# Altium schematic sheet 05-STM32.SchDoc
size A4; DocumentNumber: 5; SheetNumber: 5; SheetTotal: 8
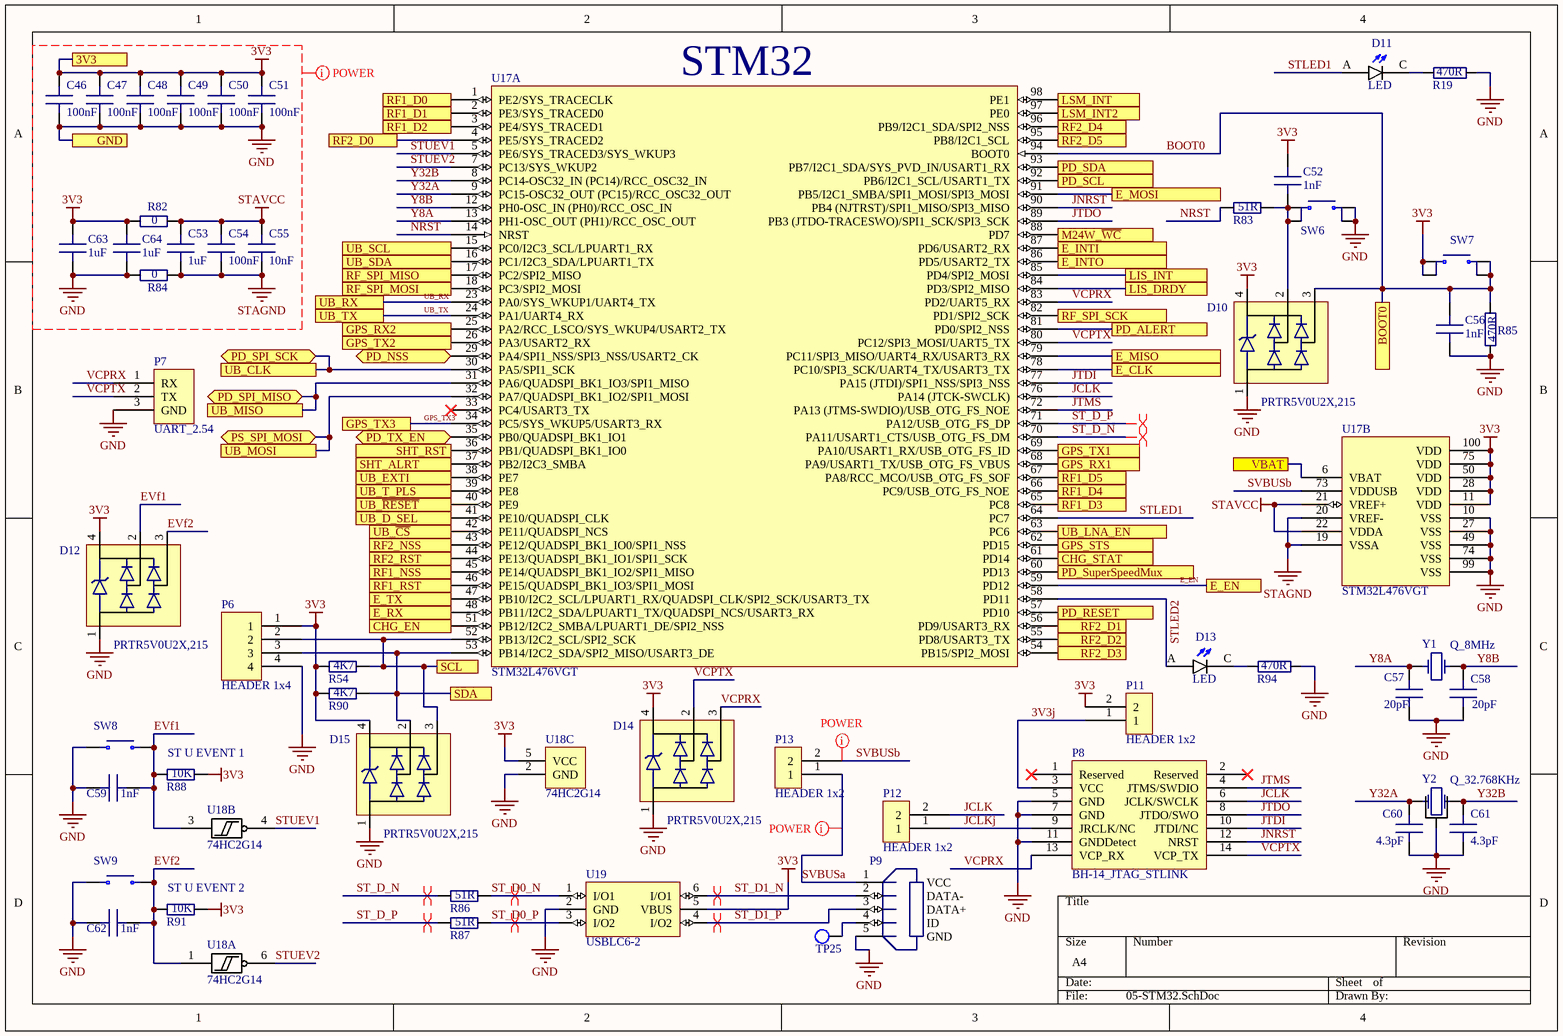
[diagram p0: 05-STM32.SchDoc]

## Parts
C46  100nF  [C0603]
C47  100nF  [C0603_NOSILK]
C48  100nF  [C0603]
C49  100nF  [C0603]
C50  100nF  [C0603]
C51  100nF  [C0603]
C52  1nF  [C0603]
C53  1uF  [C0805]
C54  100nF  [C0603]
C55  10nF  [C0603]
C56  1nF  [C0603]
C57  20pF  [C0603]
C58  20pF  [C0603]
C59  1nF  [C0603]
C60  4.3pF  [C0603]
C61  4.3pF  [C0603]
C62  1nF  [C0603]
C63  1uF  [C0805]
C64  1uF  [C0805]
D10  PRTR5V0U2X,215  [SOT143B]
D11  LED  [LED_0604]
D12  PRTR5V0U2X,215  [SOT143B]
D13  LED  [LED_0604]
D14  PRTR5V0U2X,215  [SOT143B]
D15  PRTR5V0U2X,215  [SOT143B]
P6  HEADER 1x4  [HEADER 1x4 2.54]
P7  UART_2.54  [UART_2.54]
P8  BH-14_JTAG_STLINK  [BH-14-1.27]
P9  440247-2  [CON-UUSB-F-2]  (value not drawn)
P11  HEADER 1x2  [HEADER 1x2 2.54]
P12  HEADER 1x2  [HEADER 1x2 2.54]
P13  HEADER 1x2  [HEADER 1x2 2.54]
R19  Resistance: 470R  [R0603]
R54  Resistance: 4K7  [R0603]
R82  Resistance: 0  [R0603]
R83  Resistance: 51R  [R0402]
R84  Resistance: 0  [R0603]
R85  Resistance: 470R  [R0603]
R86  Resistance: 51R  [R0402]
R87  Resistance: 51R  [R0402]
R88  Resistance: 10K  [R0603]
R90  Resistance: 4K7  [R0603]
R91  Resistance: 10K  [R0603]
R94  Resistance: 470R  [R0603]
SW6  SWITCH_GEN_4P  [SW_4x4x1.5]  (value not drawn)
SW7  SWITCH_GEN_4P  [SW_4x4x1.5]  (value not drawn)
SW8  SWITCH_GEN_2P  [SW_TACTM-35N-F]  (value not drawn)
SW9  SWITCH_GEN_2P  [SW_TACTM-35N-F]  (value not drawn)
TP25  TEST_POINT  [TP_1mm]  (value not drawn)  (no BOM)
U17  STM32L476VGT  [LQFP100_0.5]  (parts A,B of 2)
U18  74HC2G14  [SOT363/SOT65P210X110-6N]  (parts A,B,C of 3)
U19  USBLC6-2  [SOT-666]
Y1  Q_8MHz  [QSMD12.3x4.5x4.2]
Y2  Q_32.768KHz  [HC_3.0x8.0]

## Ports
3V3, BOOT0, CHG_EN, CHG_STAT, E_CLK, E_EN, E_INTI, E_INTO, E_MISO, E_MOSI, E_RX, E_TX, GND, GPS_RX1, GPS_RX2, GPS_STS, GPS_TX1, GPS_TX2, GPS_TX3, LIS_DRDY, LIS_INT, LSM_INT, LSM_INT2, M24W_~{WC}, PD_ALERT, PD_NSS (bidir), PD_RESET, PD_SCL, PD_SDA, PD_SPI_MISO (bidir), PD_SPI_SCK (bidir), PD_SuperSpeedMux, PD_TX_EN (bidir), PS_SPI_MOSI (bidir), RF1_D0, RF1_D1, RF1_D2, RF1_D3, RF1_D4, RF1_D5, RF1_NSS, RF1_RST, RF2_D0, RF2_D1, RF2_D2, RF2_D3, RF2_D4, RF2_D5, RF2_NSS, RF2_RST, RF_SPI_MISO, RF_SPI_MOSI, RF_SPI_SCK, SCL, SDA, SHT_ALRT, SHT_RST, UB_CLK, UB_D_SEL, UB_EXTI, UB_LNA_EN, UB_MISO, UB_MOSI, UB_RX, UB_SCL, UB_SDA, UB_T_PLS, UB_TX, UB_~{CS}, UB_~{RESET}, VBAT

## Nets
3V3: C46.2 C47.2 C48.2 C49.2 C50.2 C51.2 C52.1 C63.2 C64.2 D10.4(P$4) D12.4(P$4) D14.4(P$4) D15.4(P$4) P6.1 P11.2 R54.1 R82.1 R88.2 R90.1 R91.2 SW7.2 SW7.4 U17.11(VDD) U17.28(VDD) U17.50(VDD) U17.75(VDD) U17.100(VDD) U18.5(VCC) U19.5(VBUS) ; port 3V3
GND: C46.1 C47.1 C48.1 C49.1 C50.1 C51.1 C56.2 C57.1 C58.1 C59.2 C60.1 C61.1 C62.2 C63.1 C64.1 D10.1(P$1) D12.1(P$1) D14.1(P$1) D15.1(P$1) P6.4 P7.3(GND) P8.5(GND) P8.7(GND) P8.11(GNDDetect) P9.5(GND) R19.2 R84.1 R85.1 R94.2 SW6.1 SW6.3 SW8.1 SW9.1 U17.10(VSS) U17.27(VSS) U17.49(VSS) U17.74(VSS) U17.99(VSS) U18.2(GND) U19.2(GND) Y2.PAD ; port GND
STAGND: C53.1 C54.1 C55.1 R84.2 U17.19(VSSA) U17.20(VREF-)
STAVCC: C53.2 C54.2 C55.2 R82.2 U17.21(VREF+) U17.22(VDDA)
3V3j: P8.3(VCC) P11.1
BOOT0: C56.1 D10.3(P$3) R85.2 SW7.1 SW7.3 U17.94(BOOT0) ; port BOOT0
CHG_EN: U17.51(PB12/I2C2_SMBA/LPUART1_DE/SPI2_NSS) ; port CHG_EN
CHG_STAT: U17.61(PD14) ; port CHG_STAT
E_CLK: U17.78(PC10/SPI3_SCK/UART4_TX/USART3_TX) ; port E_CLK
E_EN: U17.59(PD12) ; port E_EN
E_INTI: U17.87(PD6/USART2_RX) ; port E_INTI
E_INTO: U17.86(PD5/USART2_TX) ; port E_INTO
E_MISO: U17.79(PC11/SPI3_MISO/UART4_RX/USART3_RX) ; port E_MISO
E_MOSI: U17.91(PB5/I2C1_SMBA/SPI1_MOSI/SPI3_MOSI) ; port E_MOSI
E_RX: U17.48(PB11/I2C2_SDA/LPUART1_TX/QUADSPI_NCS/USART3_RX) ; port E_RX
E_TX: U17.47(PB10/I2C2_SCL/LPUART1_RX/QUADSPI_CLK/SPI2_SCK/USART3_TX) ; port E_TX
EVf1: C59.1 D12.2(P$2) R88.1 SW8.2 U18.3(2A)
EVf2: C62.1 D12.3(P$3) R91.1 SW9.2 U18.1(1A)
GPS_RX1: U17.68(PA9/USART1_TX/USB_OTG_FS_VBUS) ; port GPS_RX1
GPS_RX2: U17.25(PA2/RCC_LSCO/SYS_WKUP4/USART2_TX) ; port GPS_RX2
GPS_STS: U17.62(PD15) ; port GPS_STS
GPS_TX1: U17.69(PA10/USART1_RX/USB_OTG_FS_ID) ; port GPS_TX1
GPS_TX2: U17.26(PA3/USART2_RX) ; port GPS_TX2
GPS_TX3: U17.34(PC5/SYS_WKUP5/USART3_RX) ; port GPS_TX3
JCLK: P8.6(JCLK/SWCLK) P12.2 U17.76(PA14_(JTCK-SWCLK))
JCLKj: P8.9(JRCLK/NC) P12.1
JNRST: P8.12(NRST) U17.90(PB4_(NJTRST)/SPI1_MISO/SPI3_MISO)
JTDI: P8.10(JTDI/NC) U17.77(PA15_(JTDI)/SPI1_NSS/SPI3_NSS)
JTDO: P8.8(JTDO/SWO) U17.89(PB3_(JTDO-TRACESWO)/SPI1_SCK/SPI3_SCK)
JTMS: P8.4(JTMS/SWDIO) U17.72(PA13_(JTMS-SWDIO)/USB_OTG_FS_NOE)
LIS_DRDY: U17.84(PD3/SPI2_MISO) ; port LIS_DRDY
LIS_INT: U17.85(PD4/SPI2_MOSI) ; port LIS_INT
LSM_INT: U17.98(PE1) ; port LSM_INT
LSM_INT2: U17.97(PE0) ; port LSM_INT2
M24W_~{WC}: U17.88(PD7) ; port M24W_~{WC}
NRST: R83.1 U17.14(NRST)
PD_ALERT: U17.81(PD0/SPI2_NSS) ; port PD_ALERT
PD_NSS: U17.29(PA4/SPI1_NSS/SPI3_NSS/USART2_CK) ; port PD_NSS
PD_RESET: U17.57(PD10) ; port PD_RESET
PD_SCL: U17.92(PB6/I2C1_SCL/USART1_TX) ; port PD_SCL
PD_SDA: U17.93(PB7/I2C1_SDA/SYS_PVD_IN/USART1_RX) ; port PD_SDA
PD_SPI_MISO: U17.31(PA6/QUADSPI_BK1_IO3/SPI1_MISO) ; port UB_MISO, port PD_SPI_MISO
PD_SPI_SCK: U17.30(PA5/SPI1_SCK) ; port PD_SPI_SCK, port UB_CLK
PD_SuperSpeedMux: U17.60(PD13) ; port PD_SuperSpeedMux
PD_TX_EN: U17.35(PB0/QUADSPI_BK1_IO1) ; port PD_TX_EN
PS_SPI_MOSI: U17.32(PA7/QUADSPI_BK1_IO2/SPI1_MOSI) ; port PS_SPI_MOSI, port UB_MOSI
RF1_D0: U17.1(PE2/SYS_TRACECLK) ; port RF1_D0
RF1_D1: U17.2(PE3/SYS_TRACED0) ; port RF1_D1
RF1_D2: U17.3(PE4/SYS_TRACED1) ; port RF1_D2
RF1_D3: U17.65(PC8) ; port RF1_D3
RF1_D4: U17.66(PC9/USB_OTG_FS_NOE) ; port RF1_D4
RF1_D5: U17.67(PA8/RCC_MCO/USB_OTG_FS_SOF) ; port RF1_D5
RF1_NSS: U17.45(PE14/QUADSPI_BK1_IO2/SPI1_MISO) ; port RF1_NSS
RF1_RST: U17.46(PE15/QUADSPI_BK1_IO3/SPI1_MOSI) ; port RF1_RST
RF2_D0: U17.4(PE5/SYS_TRACED2) ; port RF2_D0
RF2_D1: U17.56(PD9/USART3_RX) ; port RF2_D1
RF2_D2: U17.55(PD8/USART3_TX) ; port RF2_D2
RF2_D3: U17.54(PB15/SPI2_MOSI) ; port RF2_D3
RF2_D4: U17.96(PB9/I2C1_SDA/SPI2_NSS) ; port RF2_D4
RF2_D5: U17.95(PB8/I2C1_SCL) ; port RF2_D5
RF2_NSS: U17.43(PE12/QUADSPI_BK1_IO0/SPI1_NSS) ; port RF2_NSS
RF2_RST: U17.44(PE13/QUADSPI_BK1_IO1/SPI1_SCK) ; port RF2_RST
RF_SPI_MISO: U17.17(PC2/SPI2_MISO) ; port RF_SPI_MISO
RF_SPI_MOSI: U17.18(PC3/SPI2_MOSI) ; port RF_SPI_MOSI
RF_SPI_SCK: U17.82(PD1/SPI2_SCK) ; port RF_SPI_SCK
SCL: D15.3(P$3) P6.2 R54.2 U17.52(PB13/I2C2_SCL/SPI2_SCK) ; port SCL
SDA: D15.2(P$2) P6.3 R90.2 U17.53(PB14/I2C2_SDA/SPI2_MISO/USART3_DE) ; port SDA
SHT_ALRT: U17.37(PB2/I2C3_SMBA) ; port SHT_ALRT
SHT_RST: U17.36(PB1/QUADSPI_BK1_IO0) ; port SHT_RST
ST_D0_N: R86.2 U19.1(I/O1)
ST_D0_P: R87.2 U19.3(I/O2)
ST_D1_N: P9.2(DATA-) U19.6(I/O1)
ST_D1_P: P9.3(DATA+) U19.4(I/O2)
ST_D_N: R86.1 U17.70(PA11/USART1_CTS/USB_OTG_FS_DM)
ST_D_P: R87.1 U17.71(PA12/USB_OTG_FS_DP)
STLED1: D11.A U17.64(PC7)
STLED2: D13.A U17.58(PD11)
STUEV1: U17.5(PE6/SYS_TRACED3/SYS_WKUP3) U18.4(2Y)
STUEV2: U17.7(PC13/SYS_WKUP2) U18.6(1Y)
SVBUSa: P9.1(VCC) P13.1
SVBUSb: P13.2 U17.73(VDDUSB)
UB_~{CS}: U17.42(PE11/QUADSPI_NCS) ; port UB_~{CS}
UB_D_SEL: U17.41(PE10/QUADSPI_CLK) ; port UB_D_SEL
UB_EXTI: U17.38(PE7) ; port UB_EXTI
UB_LNA_EN: U17.63(PC6) ; port UB_LNA_EN
UB_~{RESET}: U17.40(PE9) ; port UB_~{RESET}
UB_RX: U17.23(PA0/SYS_WKUP1/UART4_TX) ; port UB_RX
UB_SCL: U17.15(PC0/I2C3_SCL/LPUART1_RX) ; port UB_SCL
UB_SDA: U17.16(PC1/I2C3_SDA/LPUART1_TX) ; port UB_SDA
UB_T_PLS: U17.39(PE8) ; port UB_T_PLS
UB_TX: U17.24(PA1/UART4_RX) ; port UB_TX
VBAT: U17.6(VBAT) ; port VBAT
VCPRX: D14.3(P$3) P7.1(RX) P8.13(VCP_RX) U17.83(PD2/UART5_RX)
VCPTX: D14.2(P$2) P7.2(TX) P8.14(VCP_TX) U17.80(PC12/SPI3_MOSI/UART5_TX)
Y8A: C57.2 U17.13(PH1-OSC_OUT_(PH1)/RCC_OSC_OUT) Y1.1
Y8B: C58.2 U17.12(PH0-OSC_IN_(PH0)/RCC_OSC_IN) Y1.2
Y32A: C60.2 U17.9(PC15-OSC32_OUT_(PC15)/RCC_OSC32_OUT) Y2.1
Y32B: C61.2 U17.8(PC14-OSC32_IN_(PC14)/RCC_OSC32_IN) Y2.2
NetC52_2: C52.2 D10.2(P$2) R83.2 SW6.2 SW6.4
NetD11_C: D11.C R19.1
NetD13_C: D13.C R94.1
NetP9_4: P9.4(ID) TP25.1

Not connected (* = marked no-connect by the designer): P8 1(Reserved)* 2(Reserved)*; U17 33(PC4/USART3_TX)*

## Layout directives
differential pair; net class USB: ST_D0_N, ST_D0_P, ST_D1_N, ST_D1_P, ST_D_N, ST_D_P
net class POWER_NET_CLASS: 3V3, GND, STAGND, STAVCC, SVBUSa, SVBUSb
differential pair: ST_D_N, ST_D_P

## Notes on the sheet
- (near U17) STM32
- (near R88) ST U EVENT 1
- (near R91) ST U EVENT 2

## Library data of the parts
C46-C51 C54 = C0603_100nF_16V: Ceramic capacitor; Voltage: 16V; Capacity: 100nF; Size: 0603; Value: 100nF; PriceKosmodromUAH: 1; Kosmodrom: http://www.kosmodrom.com.ua/el.php?name=CP06030.125V8020
C52 C56 C59 C62 = C0603_1nF_25V: Ceramic capacitor; Voltage: 25V; Capacity: 1nF; Size: 0603; Value: 1nF; PriceKosmodromUAH: 0,75; Kosmodrom: http://www.kosmodrom.com.ua/el.php?name=CP0603100050V10
C53 C63 C64 = C0805_1uF_25V: Ceramic capacitor; Voltage: 25V; Capacity: 1uF; Size: 0805; Value: 1uF; PriceKosmodromUAH: 1; Kosmodrom: http://www.kosmodrom.com.ua/el.php?name=CP0805125V10
C55 = C0603_10nF_16V: Ceramic capacitor; Voltage: 16V; Capacity: 10nF; Size: 0603; Value: 10nF; PriceKosmodromUAH: 0,25; Kosmodrom: http://www.kosmodrom.com.ua/el.php?name=CP06031050V10
C57 C58 = C0603_20pF_50V: Ceramic capacitor; Voltage: 25V; Capacity: 20pF; Size: 0603; Value: 20pF; PriceKosmodromUAH: 0,25; Kosmodrom: http://www.kosmodrom.com.ua/el.php?name=CP06032050V5
C60 C61 = C0603_4.3pF_50V: Ceramic capacitor; Voltage: 25V; Capacity: 4.3pF; Size: 0603; Value: 4.3pF; PriceKosmodromUAH: 0,25; Kosmodrom: http://www.kosmodrom.com.ua/el.php?name=CP06034.350V0.25
D10 D12 D14 D15 = PRTR5V0U2X,215: PRTR5V0U2X - Ultra low capacitance double rail-to-rail ESD protection diode; MF: Nexperia USA; Owned: 10; Package: SOT-143 Nexperia; Price: None; Availability: Unavailable; MP: PRTR5V0U2X,215; SnapEDA_Link: https://www.snapeda.com/parts/PRTR5V0U2X%2C215/Nexperia%20USA%20Inc./view-part/?ref=snap; Value: *; PriceKosmodromUAH: 3,25; Kosmodrom: http://www.kosmodrom.com.ua/el.php?name=PRTR5V0U2X.215
D11 D13 = LED: Led General; MF: Dialight; MP: 598-8140-107F; Owned: 3000; SnapEDA_Link: https://www.snapeda.com/parts/598-8140-107F/Dialight/view-part/?ref=snap; Price: None; Availability: Unavailable; Package: 0805 Dialight; Value: *
P8 = BH-14_JTAG_STLINK: 1,27 mm 2x7 Header; Owned: 10; PriceKosmodromUAH: 7,75; Kosmodrom: http://www.kosmodrom.com.ua/el.php?name=BH1.27-14
P9 = CON-USB-Micro/Mini: Mini/Micro USB B Type RCPT; MF: TE Connectivity; Availability: Unavailable; Package: None; MP: 440247-2; SnapEDA_Link: https://www.snapeda.com/parts/440247-2/TE%20Connectivity%20AMP%20Connectors/view-part/?ref=snap; TE_purchase_URL: https://www.te.com/usa-en/product-440247-2.html?te_bu=Cor&te_type=disp&te_campaign=seda_glo_cor-seda-global-disp-prtnr-fy19-seda-model-bom-cta_sma-317_1&elqCampaignId=32493; Price: None; Value: *; PriceKosmodromUAH: 2,5; Kosmodrom: http://www.kosmodrom.com.ua/el.php?name=ESB228110100Z
R19 R85 R94 = R0603_470R: Resistor General; Tolerance: 5%; Owned: 3000; Size: 0603
R54 R90 = R0603_4K7: Resistor General; Tolerance: 5%; Owned: 3000; Size: 0603
R82 R84 = R0603_0R: Resistor General; Tolerance: *; Size: 0603; PriceRCSUAH: 0,06; RCS: https://www.rcscomponents.kiev.ua/product/0-ohm-5-0-1w-50v-0603-rc0603jr-0r-hitano-rezistor-smd_4159.html
R83 R86 R87 = R0402_51R: Resistor General; Tolerance: *; Size: 0402; PriceKosmodromUAH: 0,03; PriceRCSUAH: 0,05; Kosmodrom: http://www.kosmodrom.com.ua/el.php?name=0402SMDRES51OM5; RCS: https://www.rcscomponents.kiev.ua/product/51-ohm-5-1-16w-50v-0402-rc0402jr-51r-hitano_11504.html
R88 R91 = R0603_10K: Resistor General; Tolerance: 5%; Owned: 3000; Size: 0603; PriceRCSUAH: 0,06; RCS: https://www.rcscomponents.kiev.ua/product/10-kohm-5-0-1w-50v-0603-rc0603jr-0710kl-yageo_107096.html
SW6 SW7 = SWITCH_GEN_4P: SWITCH DIP 4.3 mm; PriceKosmodromUAH: 0,5; Kosmodrom: http://www.kosmodrom.com.ua/el.php?name=TACT-5X5X1.5
SW8 SW9 = SWITCH_GEN_2P: SWITCH DIP 4.3 mm; PriceKosmodromUAH: 1,25; Kosmodrom: http://www.kosmodrom.com.ua/el.php?name=TACT-35N-F
U17 = STM32L476VGT: Ultra-low-power Cortex-M4 32-bit MCU+FPU, 100DMIPS, up to 1MB Flash, 128 KB SRAM, USB OTG FS, LCD; Owned: 6; PriceUAH: 253,84; OtherUA: https://step-elektronika.prom.ua/p499466797-mikrokontroller-shirokogo-naznacheniya.html
U18 = 74HC2G14: Dual inverting Schmitt trigger; PriceKosmodromUAH: 4,5; Kosmodrom: http://www.kosmodrom.com.ua/el.php?name=74HC2G14GW.125
U19 = USBLC6-2: Very low capacitance ESD protection; PriceKosmodromUAH: 4,25; Kosmodrom: http://www.kosmodrom.com.ua/el.php?name=USBLC6-2P6
Y1 = Q_8MHz: Quartz resonator 8MHz; PriceKosmodromUAH: 6; Kosmodrom: http://www.kosmodrom.com.ua/el.php?name=KX-K-8.0-MHz
Y2 = Q_32.768KHz: Quartz resonator 32.768KHz; PriceKosmodromUAH: 5; Kosmodrom: http://www.kosmodrom.com.ua/el.php?name=KX-38T-32.768-kHz-6pF